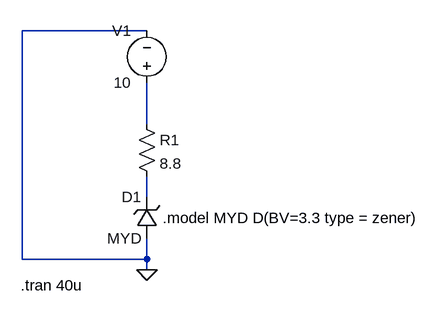
[diagram p0: schematic Zener Diode.asc]
Zener Diode.asc, the LTspice schematic file:
Version 4
SHEET 1 880 680
WIRE 192 16 0 16
WIRE 192 160 192 96
WIRE 192 272 192 240
WIRE 0 368 0 16
WIRE 192 368 192 336
WIRE 192 368 0 368
WIRE 192 384 192 368
FLAG 192 384 0
SYMBOL res 176 144 R0
SYMATTR InstName R1
SYMATTR Value 8.8
SYMBOL zener 208 336 R180
WINDOW 0 24 64 Left 2
WINDOW 3 24 0 Left 2
SYMATTR InstName D1
SYMATTR Value MYD
SYMBOL voltage 192 112 R180
WINDOW 0 24 96 Left 2
WINDOW 3 24 16 Left 2
WINDOW 123 0 0 Left 0
WINDOW 39 0 0 Left 0
SYMATTR InstName V1
SYMATTR Value 10
TEXT 216 304 Left 2 !.model MYD D(BV=3.3 type = zener)
TEXT -2 408 Left 2 !.tran 40u

The netlist it stands for:
* Zener Diode.asc
R1 N001 N002 8.8
D1 0 N002 MYD
V1 N001 0 10
.model D D
.lib standard.dio
.model MYD D(BV=3.3 type = zener)
.tran 40u
.backanno
.end